# EAGLE design TaaraESP-USB-SHT21-v4 (EAGLE 9.6.2)
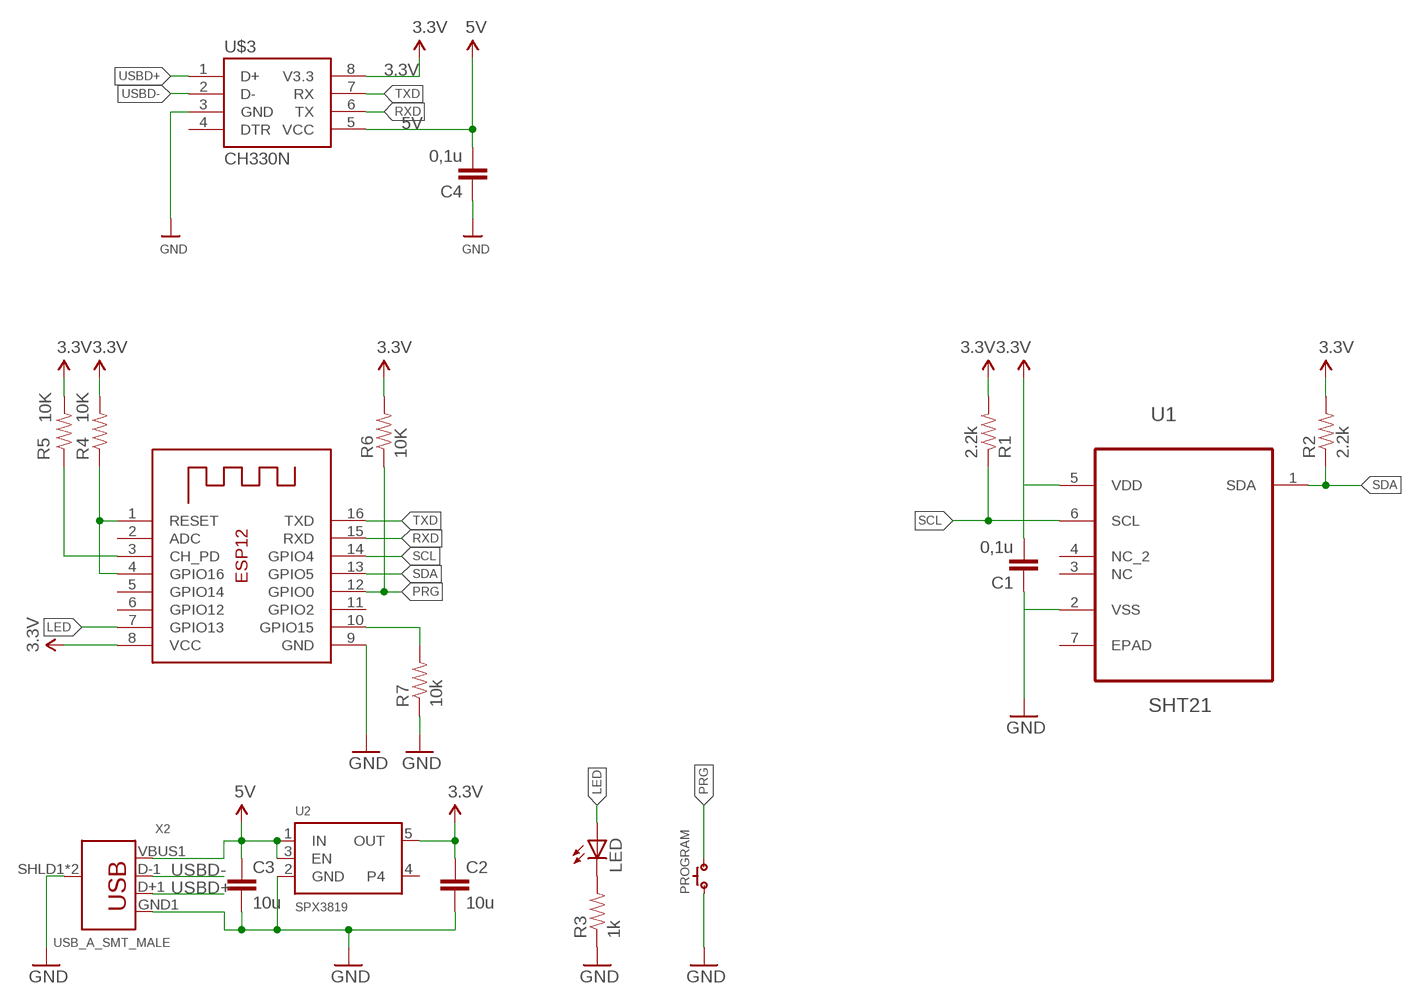
[diagram p0: schematic, sheet 1]

## Parts
C1  0,1u  CAP0805  [0805]
C2  10u  CAP0805  [0805]
C3  10u  CAP0805  [0805]
C4  0,1u  CAP0805  [0805]
LED  LEDCHIPLED_0603  [CHIPLED_0603]
PROGRAM  SPST.B3U-1000P(M)-B  [B3U-1000P(M)-B]
R1  2.2k  RESISTOR0805-RES  [0805]
R2  2.2k  RESISTOR0805-RES  [0805]
R3  1k  RESISTOR0805-RES  [0805]
R4  10K  RESISTOR0805-RES  [0805]
R5  10K  RESISTOR0805-RES  [0805]
R6  10K  RESISTOR0805-RES  [0805]
R7  10k  RESISTOR0805-RES  [0805]
U1  SHT21  [DFN300X300X110-7N]
U2  SPX3819  VREG_SOT23-5  [SOT23-5]
U$3  CH330N  [SOIC8]
X1  ESP-12S  ESP-12  [ESP-12]
X2  USB_A_SMT_MALE  [USB-A-SMT-MALE]

## Nets
3.3V: C1.2 C2.1 R1.2 R2.2 R4.2 R5.2 R6.2 U1.5(VDD) U2.5(OUT) U$3.8(V3.3) X1.8(VCC)
5V: C3.1 C4.2 U2.1(IN) U2.3(EN) U$3.5(VCC) X2.VBUS1(VBUS)
GND: C1.1 C2.2 C3.2 C4.1 PROGRAM.1 R3.1 R7.1 U1.2(VSS) U2.2(GND) U$3.3(GND) X1.9(GND) X2.GND1(GND) X2.SHLD1(SHIELD) X2.SHLD2(SHIELD)
LED: LED.A X1.7(GPIO13)
N$1: LED.C R3.2
N$2: R4.1 X1.1(RESET) X1.4(GPIO16)
N$3: R5.1 X1.3(CH_PD)
N$4: R7.2 X1.10(GPIO15)
PRG: PROGRAM.2 R6.1 X1.12(GPIO0)
RXD: U$3.6(TX) X1.15(RXD)
SCL: R1.1 U1.6(SCL) X1.14(GPIO4)
SDA: R2.1 U1.1(SDA) X1.13(GPIO5)
TXD: U$3.7(RX) X1.16(TXD)
USBD+: U$3.1(D+) X2.D+1(D+)
USBD-: U$3.2(D-) X2.D-1(D-)
Unconnected: U1.3(NC) U1.4(NC_2) U1.7(EPAD) U2.4 X1.2(ADC) X1.5(GPIO14) X1.6(GPIO12) X1.11(GPIO2)

## Power pins joined to a net without a drawn wire
DTR: U$3.4(DTR)

## Library data of the parts
C1-C4 = SparkFun:CAP: Capacitor Standard 0603 ceramic capacitor, and 0.1" leaded capacitor.
LED = adafruit:LED: LED OSRAM: - CHIPLED LG R971, LG N971, LY N971, LG Q971, LY Q971, LO R971, LY R971 LH N974, LH R974 LS Q976, LO Q976, LY Q976 LO Q996 - Hyper CHIPLED LW Q18S LB Q993, LB Q99A, LB R99A - SideLED LS A670, LO A670, LY A670, LG A670, LP A670 LB A673, LV A673, LT A673, LW A673 LH A674 LY A675 LS A676, LA A676, LO A676, LY A676, LW A676 LS A679, LY A679, LG A679 - Hyper Micro SIDELED® LS Y876, LA Y876, LO Y876, LY Y876 LT Y87S - SmartLED LW L88C, LW L88S LB L89C, LB L89S, LG L890 LS L89K, LO L89K, LY L89K LS L896, LA L896, LO L896, LY L896 - TOPLED LS T670, LO T670, LY T670, LG T670, LP T670 LSG T670, LSP T670, LSY T670, LOP T670, LYG T670 LG T671, LOG T671, LSG T671 LB T673, LV T673, LT T673, LW T673 LH T674 LS T676, LA T676, LO T676, LY T676, LB T676, LH T676, LSB T676, LW T676 LB T67C, LV T67C, LT T67C, LS T67K, LO T67K, LY T67K, LW E67C LS E67B, LA E67B, LO E67B, LY E67B, LB E67C, LV E67C, LT E67C LW T67C LS T679, LY T679, LG T679 LS T770, LO T770, LY T770, LG T770, LP T770 LB T773, LV T773, LT T773, LW T773 LH T774 LS E675, LA E675, LY E675, LS T675 LS T776, LA T776, LO T776, LY T776, LB T776 LHGB T686 LT T68C, LB T68C - Hyper Mini TOPLED® LB M676 - Mini TOPLED Santana® LG M470 LS M47K, LO M47K, LY M47K Source: http://www.osram.convergy.de/
PROGRAM = omron:SPST
R1-R7 = SparkFun:RESISTOR: Resistor Basic schematic elements and footprints for 0603, 1206, and PTH resistors.
U1 = Sensirion-SHT21:SHT21: SENSOR, HUMIDITY & TEMP; MPN: SHT21; OC_FARNELL: 1855468; OC_NEWARK: 20T1172; PACKAGE: DFN-6; SUPPLIER: SENSIRION
U2 = microbuilder:VREG_SOT23-5: SOT23-5 Fixed Voltage Regulators Part Current Out V Out V In V Dropout θJA (°C/W) TJ (°C) Digikey Part No. ADP121 150mA 3.3V 3.4-5.5V 0.09V @ 150mA -- -- ADP121-AUJZ33R7CT-ND ADP121 150mA 3.0V 3.1-5.5V 0.09V @ 150mA -- -- ADP121-AUJZ30R7CT-ND ADP122 300mA 3.3V 3.4-5.5V 0.085V @ 300mA -- -- ADP122AUJZ-3.3-R7CT-ND ADP1712 300mA 3.3V 3.5-5.5V 0.17V @ 300mA -- -- ADP1712AUJZ-3.3-R7TR-ND AP7311 (Low Cost) 150mA 3.3V 3.5-6V 0.15V @ 150mA -- -- AP7311-33WG-7DICT-ND LD39015M18R 150mA 1.8V 1.9V-5.5V 0.08V @ 100mA -- -- 497-6977-1-ND LP2985A-33DBVR 150mA 3.3V 3.3-16V 0.28V @ 150mA 206 150 296-18479-1-ND MCP1824T-3302E/OT 300mA 3.3V 3.5V-6V 0.2V @ 300mA -- -- MCP1824T-3302E/OTCT-ND MIC5205-2.5YM5 TR 150mA 2.5V 2.7-16V 0.165V @ 150mA -- -- 576-1257-2-ND MIC5205-3.0YM5 TR 150mA 3.0V 3.2V-16V 0.165V @ 150mA -- -- 576-1258-2-ND MIC5205-3.3YM5 TR 150mA 3.3V 3.5V-16V 0.165V @ 150mA -- -- 576-1259-2-ND TPS780330220 150mA 3.3V+2.2V 3.6-5.5V 250mV Max -- -- 296-23332-1-ND TDA3663/N1,135 100mA 3.3V 3.5-45V 0.18V @ 50mA -- -- 568-5343-1-ND Max operating temp can be calculated using θJA, TJ (max junction temperature), and power in watts. Set the "Maximum Ambient Temperature" until it reaches TJ ("Max Junction Temperature"), which is the absolute limit for safe use of the regulator: Heat Sink Temperature Calculator <http://www.daycounter.com/Calculators/Heat-Sink-Temperature-Calculator.phtml> For example, With 12V source into a 3.3V LP2985 and a 30mA load, we are dissipating (12V-3.3V) * 0.03A = 0.261W. With a θJA of 206 °C/W, a TJ of 150°C, and 261mW we can safely use the chip without a heat sink up to 75°C (=147.1°C Junction Temperature).
U$3 = ch330n:CH330N
X1 = microbuilder:ESP-12
X2 = SparkFun-Connectors:USB_A: USB-A Connector Male and female variants, as well as PTH and SMT variants SparkFun Products: SparkFun XBee Explorer Dongle <https://www.sparkfun.com/products/11697> PTH Male SparkFun MicroView-USB Programmer <https://www.sparkfun.com/products/12924> SMT Male SparkFun USB Type A Female Breakout <https://www.sparkfun.com/products/12700> SMT Female; PROD_ID: CONN-11499

## Net classes
0 default: width 0.2 mm
1 power: width 0.2 mm

## Board
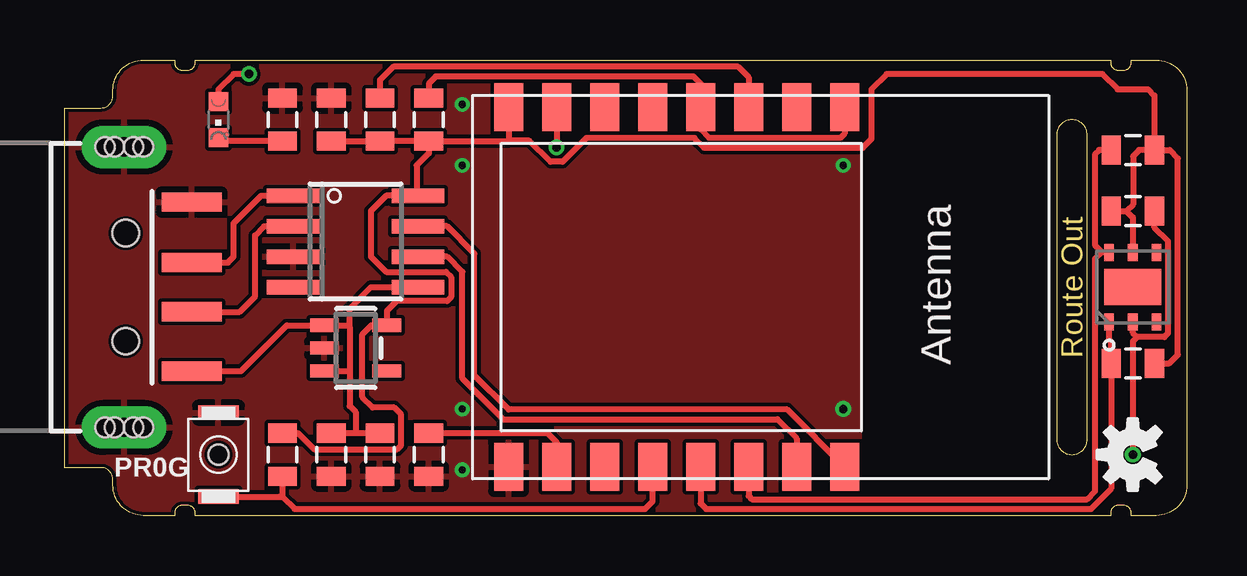
[diagram p1: board, top side]
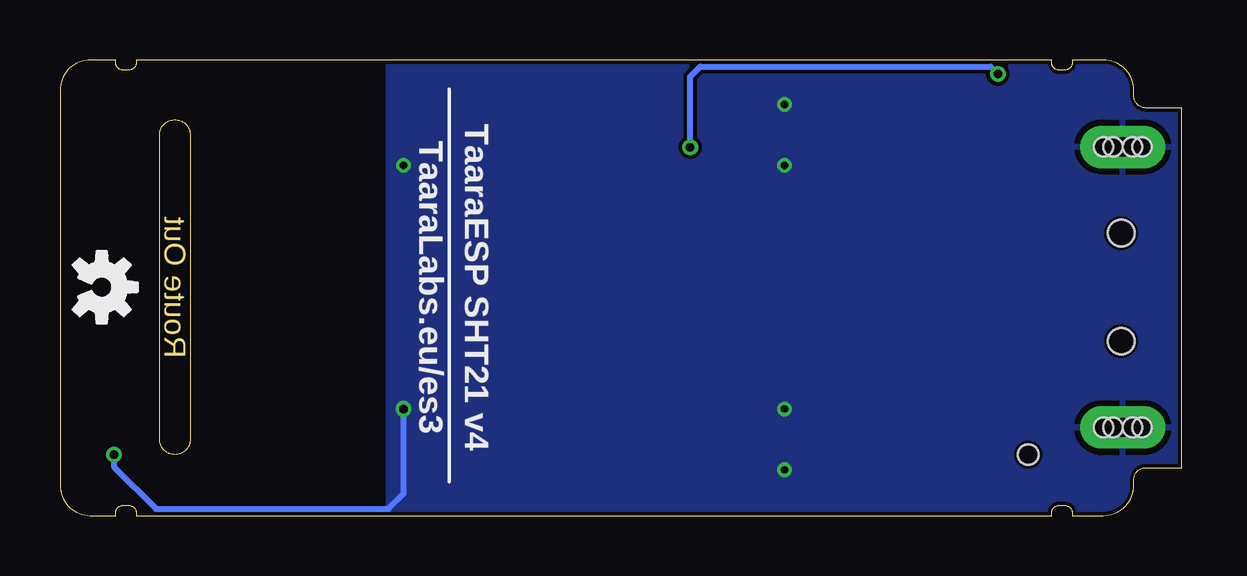
[diagram p2: board, bottom side, seen from below]

Size 46.75 x 19 mm. Coordinates in mm from the lower left corner, seen from the top.
Outline: 41.32,15.88 41.32,3.17 arc90 41.96,2.54 arc90 42.59,3.17 42.59,15.88 arc90 41.96,16.51 arc90 41.32,15.88
Outline: 4.57,0 3.27,0 arc-90 2,1.27 2,1.5 arc90 1.5,2 0,2 0,17 1.5,17 arc90 2,17.5 2,17.73 arc-90 3.27,19 4.57,19 4.57,18.89 arc90 4.89,18.57 5.11,18.57 arc90 5.43,18.89 5.43,19 43.57,19 43.57,18.89 arc90 43.89,18.57 44.11,18.57 arc90 44.43,18.89 44.43,19 45.48,19 arc-90 46.75,17.73 46.75,1.27 arc-90 45.48,0 44.43,0 44.43,0.11 arc90 44.11,0.43 43.89,0.43 arc90 43.57,0.11 43.57,0 5.43,0 5.43,0.11 arc90 5.11,0.43 4.89,0.43 arc90 4.57,0.11 4.57,0
Copper layers (1*16): Top 0.035mm / dielectric 1.5mm / Bottom 0.035mm
Design rules "default *": minimum track width 10mil, minimum drill 12mil, track to track 6mil, track to pad 6mil, pad to pad 6mil, via to via 6mil, smd to smd 0mil, copper to edge 6mil, drill to drill 10mil, minimum pad ring 10mil, minimum via ring 6mil, stop-mask expansion 2mil, vias tented up to drill 100mil, thermal gap 10mil

### Footprints (pad centres in the part's own frame; a part is rotated, then mirrored left to right if it is on the bottom)
0805 = smd 0.8 x 1.2: 1 -0.9,0; 2 0.9,0
CHIPLED_0603 = smd 0.8 x 0.8: A 0,-0.75; C 0,0.75
B3U-1000P(M)-B = smd 0.6 x 1.7: 1 -1.75,0; 2 1.75,0 | hole 0.85: 0,0
DFN300X300X110-7N = smd 0.711 x 0.406: 1 -1.448,0.991; 2 -1.448,0; 3 -1.448,-0.991; 4 1.448,-0.991; 5 1.448,0; 6 1.448,0.991 | smd 1.499 x 2.388: 7 0,0
SOT23-5 = smd 0.55 x 1.2: 1 -0.95,-1.3; 2 0,-1.3; 3 0.95,-1.3; 4 0.95,1.3; 5 -0.95,1.3
SOIC8 = smd 0.6 x 2.2: 1 -1.905,-2.6; 2 -0.635,-2.6; 3 0.635,-2.6; 4 1.905,-2.6; 5 1.905,2.6; 6 0.635,2.6; 7 -0.635,2.6; 8 -1.905,2.6
ESP-12 = smd 2 x 1.2: 1 -7.5,4.5; 2 -7.5,2.5; 3 -7.5,0.5; 4 -7.5,-1.5; 5 -7.5,-3.5; 6 -7.5,-5.5; 7 -7.5,-7.5; 8 -7.5,-9.5; 9 7.5,-9.5; 10 7.5,-7.5; 11 7.5,-5.5; 12 7.5,-3.5; 13 7.5,-1.5; 14 7.5,0.5; 15 7.5,2.5; 16 7.5,4.5
USB-A-SMT-MALE = smd 2.5 x 0.8: D+1 10.95,1.027; D-1 10.95,-1.027; GND1 10.95,3.551; VBUS1 10.95,-3.5 | drill 0.8 pad 1.778 long: SHLD1 8.13,-5.85; SHLD2 8.13,5.85 | hole 1.1: 8.2,2.25; 8.2,-2.25 | hole 0.8: 8.53,-5.85; 8.93,-5.85; 7.73,-5.85; 7.33,-5.85; 8.53,5.85; 8.93,5.85; 7.73,5.85; 7.33,5.85

### Placement (x,y rotation side)
C1  44.5,12.7 180 top
C2  11.1,16.51 90 top
C3  13.13,2.54 270 top
C4  11.1,2.54 90 top
LED  6.4,16.51 180 top
PROGRAM  6.4,2.54 270 top
R1  44.5,15.24 0 top
R2  44.5,6.35 0 top
R3  9.07,16.51 270 top
R4  15.16,16.51 270 top
R5  13.13,16.51 270 top
R6  9.07,2.54 90 top
R7  15.16,2.54 90 top
U1  44.5,9.53 90 top
U2  12.11,6.99 270 top
U$1  [OSHW-LOGO-S]  44.5,2.54 90 top
U$3  12.11,11.43 270 top
U$5  [OSHW-LOGO-S]  45.01,9.53 270 bottom
X1  27.99,9.53 270 top
X2  -5.67,9.53 0 top

### Tracks (layer width: path | path; a pad name or v marks a point on that pad's centre or on a via)
3.3V
  Top 0.254: 18.34,17.02 X1.8 18.49,15.63 | R4.2 R5.2 C2.1 | R4.2 18.46,15.61 18.49,15.63 | R4.2 15.16,15.11 14.65,14.61 14.65,13.34 U$3.8 13.38,13.34 12.75,12.7 12.75,10.79 13.38,10.16 15.87,10.16 16.09,9.94 16.09,9.11 15.93,8.95 13.82,8.95 13.41,8.54 U2.5 12.77,7.93 12.39,7.55 12.39,4.93 12.82,4.5 13.72,4.5 14.01,4.21 14.01,2.92 13.85,2.76 10.38,2.76 9.7,3.44 R6.2 | 18.49,15.63 19.36,15.63 20.24,14.75 20.74,14.75 21.73,15.75 26.22,15.75 26.63,15.34 33.24,15.34 33.61,15.7 33.61,17.78 34.24,18.41 43.23,18.41 43.86,17.78 45.13,17.78 45.4,17.52 R1.2 | R1.2 44.76,15.24 44.51,14.99 44.51,12.98 44.23,12.7 | 44.23,12.7 44.5,12.44 U1.5 | C1.2 44.23,12.7 | R1.2 46.03,15.24 46.38,14.89 46.38,6.71 46.02,6.35 R2.2
5V
  Top 0.254: C4.2 12.11,3.44 | 12.11,3.44 C3.1 | U2.3 11.86,6.04 | 11.86,7.87 11.86,6.04 | 11.86,6.04 11.86,4.57 12.11,4.32 12.11,3.44 | U$3.5 12.75,9.53 11.86,8.64 11.86,7.87 | X2.VBUS1 7.34,6.03 9.25,7.93 U2.1 11.8,7.93 11.86,7.87
GND  (via drill 0.3, 0.35)
  Top 0.254: C1.1 45.4,12.02 45.97,11.44 45.97,7.61 45.81,7.44 44.68,7.44 | 44.53,8.08 U1.2 44.5,7.62 44.68,7.44 | 44.68,7.44 44.5,7.26 v44.5,2.54
  Bottom 0.254: v44.5,2.54 44.5,2.03 42.74,0.28 33.07,0.28 32.43,0.91 v32.43,4.45
  other vias: 16.56,14.61 16.56,4.45 32.43,14.61 16.56,1.91 16.56,17.14
  pour Top: 0.05,19.05 33.07,19.05 33.07,0 0.05,0
  pour Bottom: 0.05,19.05 33.07,19.05 33.07,0 0.05,0
LED  (via drill 0.35)
  Top 0.254: X1.7 v20.49,15.36 | v7.67,18.41 7.03,18.41 6.4,17.78 LED.A
  Bottom 0.254: v20.49,15.36 20.49,18.3 20.06,18.72 7.97,18.72 v7.67,18.41
N$1
  Top 0.254: R3.2 6.4,15.61 LED.C
N$2
  Top 0.254: X1.1 32.49,15.93 32.3,15.75 26.85,15.75 26.49,16.11 X1.4 26.72,17.25 26.72,17.78 26.19,18.3 15.45,18.3 15.16,18.02 R4.1
N$3
  Top 0.254: X1.3 28.49,18.28 28.06,18.71 13.68,18.71 13.13,18.16 R5.1
N$4
  Top 0.254: R7.2 20.1,3.44 20.49,3.06 X1.10
PRG
  Top 0.254: X1.12 24.49,0.59 24.18,0.28 9.57,0.28 9.06,0.79 | PROGRAM.2 8.94,0.79 9.06,0.79 | R6.1 9.07,0.79 9.06,0.79
RXD
  Top 0.254: X1.15 30.49,3.21 29.69,4.01 18.26,4.01 16.56,5.71 16.56,10.16 15.92,10.79 U$3.6
SCL
  Top 0.254: R1.1 43.09,15.24 42.92,15.07 42.92,11.28 43.23,10.97 | U1.6 43.23,10.97 | 43.23,10.97 43.18,10.97 42.92,10.71 42.92,1.01 42.59,0.69 28.62,0.69 28.49,0.82 X1.14
SDA
  Top 0.254: U1.1 43.51,7.33 43.6,7.24 R2.1 43.6,1.12 42.76,0.28 26.72,0.28 26.49,0.51 X1.13
TXD
  Top 0.254: X1.16 30.09,4.42 18.49,4.42 17.07,5.84 17.07,10.92 15.92,12.06 U$3.7
USBD+
  Top 0.254: X2.D+1 6.79,10.55 7.03,10.79 7.03,12.19 8.18,13.34 U$3.1
USBD-
  Top 0.254: X2.D-1 7.28,8.5 7.92,9.14 7.92,11.68 8.3,12.06 U$3.2

### Text on the board
Dimension: Route Out
tNames: PR0G
_bsilk: TaaraESP SHT21 v4 | TaaraLabs.eu/es3